# Altium schematic sheet GPS.SchDoc
size A; SheetNumber: 4; SheetTotal: 7
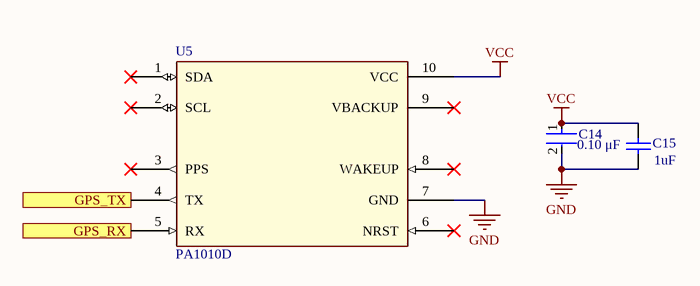
[diagram p0: GPS.SchDoc]

## Parts
C14  Capacitance: 0.10 μF  [FP-C0603C-CF-MFG]  (hidden comment: C0603C104K5RACTU)
C15  Capacitance: 1uF  [CAPC2013X135X45LL10T25]  (hidden comment: GRM21BR71H105KA12L)
U5  PA1010D  [PA1010D]

## Ports
GPS_RX (in), GPS_TX (out)

## Nets
GND: C14.2 C15.1 U5.7(GND)
VCC: C14.1 C15.2 U5.10(VCC)
GPS_RX: U5.5(RX) ; port GPS_RX
GPS_TX: U5.4(TX) ; port GPS_TX

Not connected (* = marked no-connect by the designer): U5 1(SDA)* 2(SCL)* 3(PPS)* 6(NRST)* 8(WAKEUP)* 9(VBACKUP)*

## Library data of the parts
C14 = CMP-2006-03061-2: CAP CER 0.1UF 50V X7R 0603; Manufacturer: KEMET; Tolerance: 0.1; Temperature Coefficient: 30ppm/°C; Material: Ceramic; Automotive Grade: Grade 1; Value: 0.10 μF; Temperature: -55°C to +125°C; RoHS: TRUE; Temperature Range High: +125°C; Lead Free: Yes; Octopart: https://octopart.com/c0603c104k5ractu-kemet-139244; Digikey Description: CAP CER 0.1UF 50V X7R 0603; Category: Cap; Package: C0603C-CF; ComponentLink2Description: Datasheet; Temperature Range Low: -55°C; Device Class L1: Passive Components; Voltage Rating: 50 V; Automotive: Yes; Device Class L3: Ceramic Capacitors; ComponentLink2URL: https://api.kemet.com/component-edge/download/datasheet/C0603C100J5GACAUTO.pdf; Device Class L2: Capacitors; Manufacturer Part Number: C0603C104K5RACTU; Temperature Characteristic: X7R; Height: 0.87mm
C15 = CMP-1036-04761-2: Manufacturer: Murata; Part Number: GRM21BR71H105KA12L
U5 = PA1010D: Ultraminiature GPS Module 10x10x6.8mm